# Altium schematic sheet [1] Schematic Blocks.SchDoc
size A; SheetNumber: 1; SheetTotal: 1
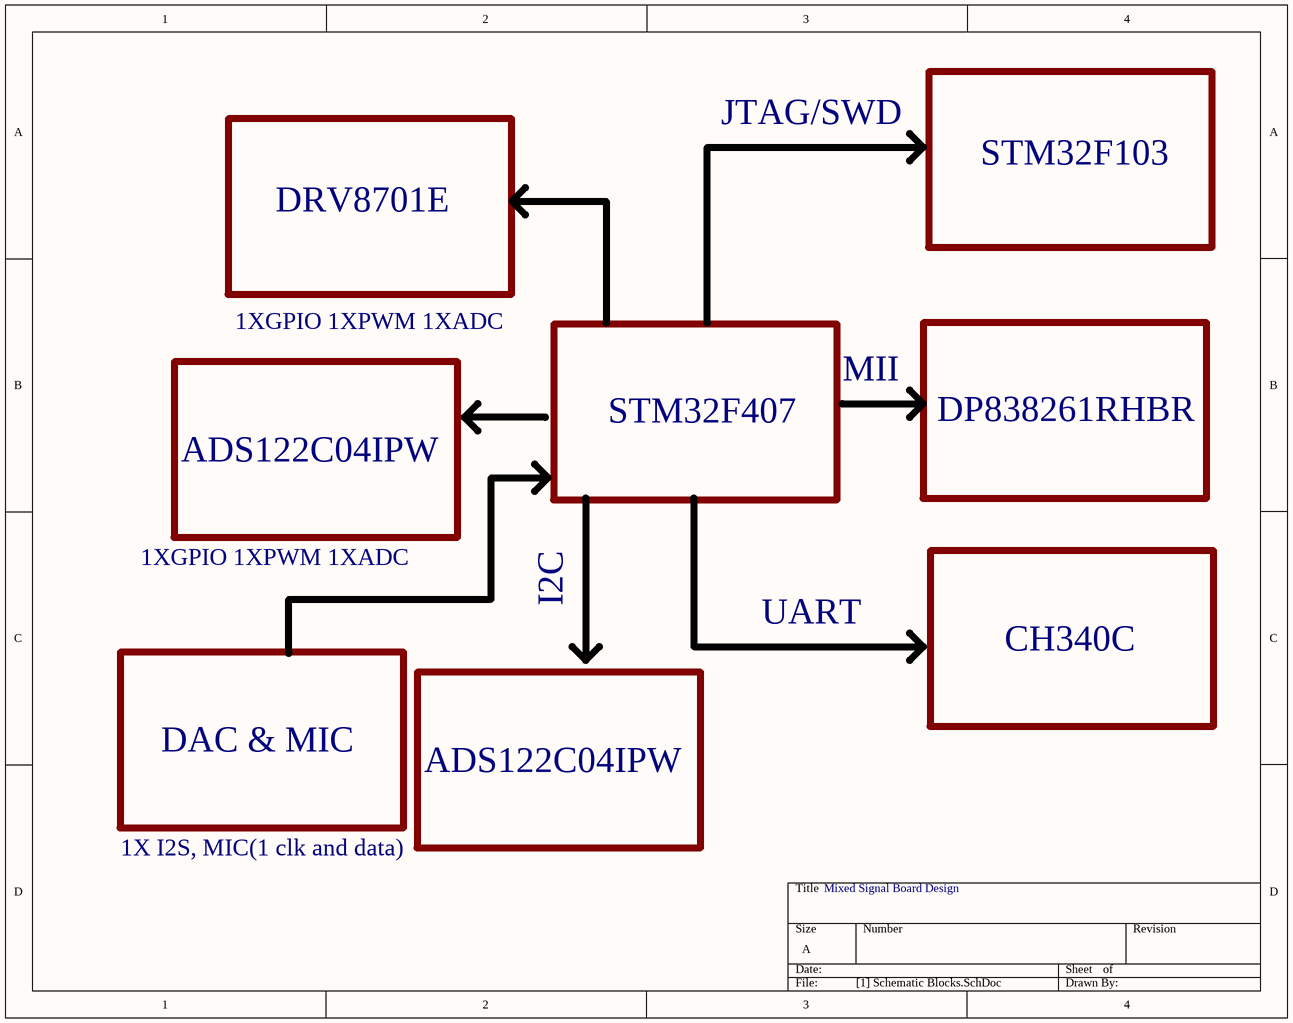
[diagram p0: [1] Schematic Blocks.SchDoc]

## Notes on the sheet
- JTAG/SWD
- DRV8701E
- STM32F103
- 1XGPIO 1XPWM 1XADC
- STM32F407
- MII
- DP838261RHBR
- ADS122C04IPW
- I2C
- UART
- CH340C
- DAC & MIC
- 1X I2S, MIC(1 clk and data)
- Mixed Signal Board Design